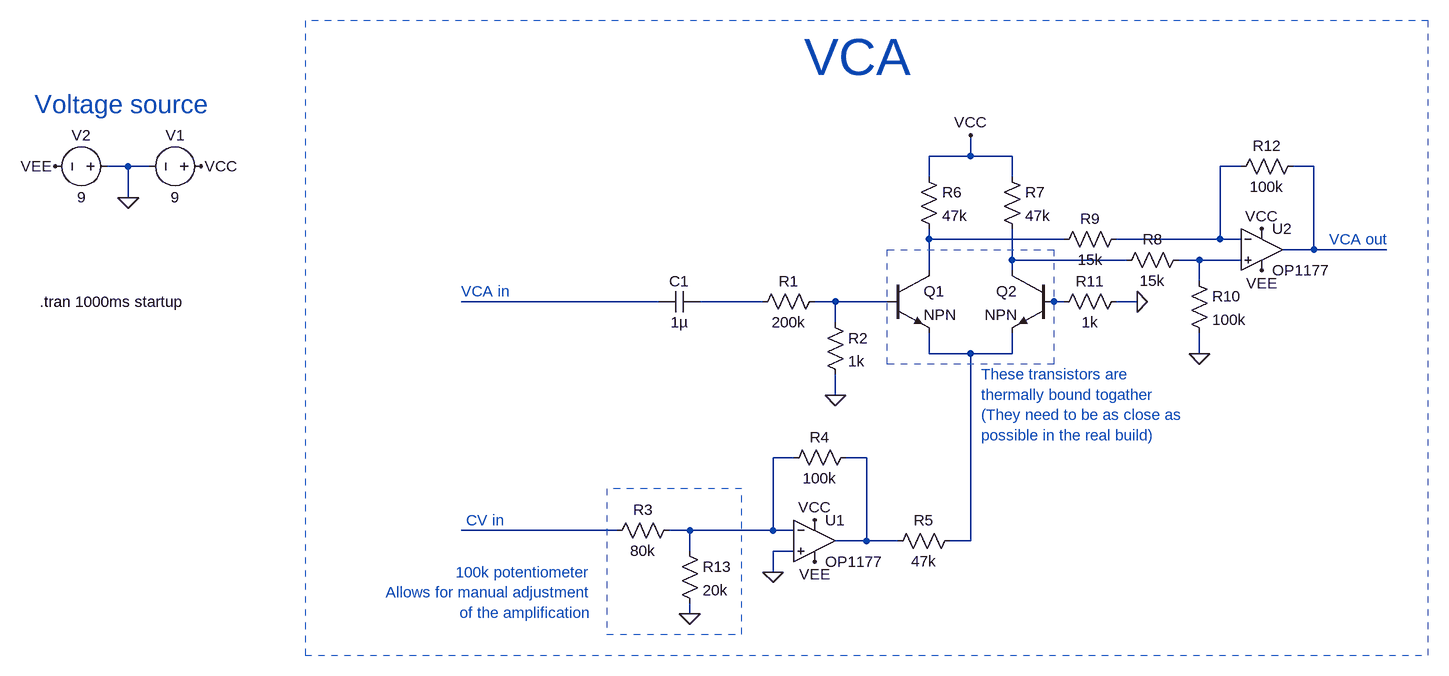
[diagram p0: schematic VCA-simulation.asc]
VCA-simulation.asc, the LTspice schematic file:
Version 4.1
SHEET 1 2860 1860
WIRE 2112 -16 2112 -48
WIRE 2112 -16 2048 -16
WIRE 2176 -16 2112 -16
WIRE 816 0 784 0
WIRE 848 0 816 0
WIRE 2528 0 2496 0
WIRE 2640 0 2608 0
WIRE 2048 16 2048 -16
WIRE 2176 16 2176 -16
WIRE 816 48 816 0
WIRE 2048 112 2048 96
WIRE 2256 112 2048 112
WIRE 2496 112 2496 0
WIRE 2496 112 2336 112
WIRE 2528 112 2496 112
WIRE 2640 128 2640 0
WIRE 2640 128 2592 128
WIRE 2752 128 2640 128
WIRE 2176 144 2176 96
WIRE 2352 144 2176 144
WIRE 2464 144 2432 144
WIRE 2528 144 2464 144
WIRE 2048 160 2048 112
WIRE 2176 160 2176 144
WIRE 2464 176 2464 144
WIRE 1632 208 1328 208
WIRE 1792 208 1696 208
WIRE 1904 208 1872 208
WIRE 1984 208 1904 208
WIRE 2240 208 2224 208
WIRE 2256 208 2240 208
WIRE 2368 208 2336 208
WIRE 1904 240 1904 208
WIRE 2048 288 2048 256
WIRE 2112 288 2048 288
WIRE 2176 288 2176 256
WIRE 2176 288 2112 288
WIRE 2464 288 2464 256
WIRE 1904 352 1904 320
WIRE 1840 448 1808 448
WIRE 1952 448 1920 448
WIRE 1568 560 1328 560
WIRE 1680 560 1648 560
WIRE 1808 560 1808 448
WIRE 1808 560 1680 560
WIRE 1840 560 1808 560
WIRE 1952 576 1952 448
WIRE 1952 576 1904 576
WIRE 2000 576 1952 576
WIRE 2112 576 2112 288
WIRE 2112 576 2080 576
WIRE 1680 592 1680 560
WIRE 1840 592 1808 592
WIRE 1808 624 1808 592
WIRE 1680 688 1680 672
FLAG 1904 352 0
FLAG 1808 624 0
FLAG 1872 544 VCC
FLAG 1872 608 VEE
FLAG 2112 -48 VCC
FLAG 2464 288 0
FLAG 2368 208 0
FLAG 2560 160 VEE
FLAG 2560 96 VCC
FLAG 1680 688 0
FLAG 704 0 VEE
FLAG 928 0 VCC
FLAG 816 48 0
SYMBOL cap 1696 192 R90
WINDOW 0 0 32 VBottom 2
WINDOW 3 32 32 VTop 2
SYMATTR InstName C1
SYMATTR Value 1µ
SYMBOL res 1888 192 R90
WINDOW 0 0 56 VBottom 2
WINDOW 3 32 56 VTop 2
SYMATTR InstName R1
SYMATTR Value 200k
SYMBOL res 1888 224 R0
SYMATTR InstName R2
SYMATTR Value 1k
SYMBOL npn 1984 160 R0
SYMATTR InstName Q1
SYMBOL npn 2240 160 M0
SYMATTR InstName Q2
SYMBOL res 1664 544 R90
WINDOW 0 0 56 VBottom 2
WINDOW 3 32 56 VTop 2
SYMATTR InstName R3
SYMATTR Value 80k
SYMBOL OpAmps\\OP1177 1872 512 R0
SYMATTR InstName U1
SYMBOL res 1936 432 R90
WINDOW 0 0 56 VBottom 2
WINDOW 3 32 56 VTop 2
SYMATTR InstName R4
SYMATTR Value 100k
SYMBOL res 2096 560 R90
WINDOW 0 0 56 VBottom 2
WINDOW 3 32 56 VTop 2
SYMATTR InstName R5
SYMATTR Value 47k
SYMBOL res 2032 0 R0
SYMATTR InstName R6
SYMATTR Value 47k
SYMBOL res 2160 0 R0
SYMATTR InstName R7
SYMATTR Value 47k
SYMBOL res 2448 128 R90
WINDOW 0 0 56 VBottom 2
WINDOW 3 32 56 VTop 2
SYMATTR InstName R8
SYMATTR Value 15k
SYMBOL res 2352 96 R90
WINDOW 0 0 56 VBottom 2
WINDOW 3 32 56 VTop 2
SYMATTR InstName R9
SYMATTR Value 15k
SYMBOL res 2448 160 R0
SYMATTR InstName R10
SYMATTR Value 100k
SYMBOL OpAmps\\OP1177 2560 64 R0
SYMATTR InstName U2
SYMBOL res 2240 224 R270
WINDOW 0 32 56 VTop 2
WINDOW 3 0 56 VBottom 2
SYMATTR InstName R11
SYMATTR Value 1k
SYMBOL res 2624 -16 R90
WINDOW 0 0 56 VBottom 2
WINDOW 3 32 56 VTop 2
SYMATTR InstName R12
SYMATTR Value 100k
SYMBOL res 1664 576 R0
SYMATTR InstName R13
SYMATTR Value 20k
SYMBOL voltage 944 0 R90
WINDOW 0 -32 56 VBottom 2
WINDOW 3 32 56 VTop 2
SYMATTR InstName V1
SYMATTR Value 9
SYMBOL voltage 800 0 R90
WINDOW 0 -32 56 VBottom 2
WINDOW 3 32 56 VTop 2
SYMATTR InstName V2
SYMATTR Value 9
TEXT 1856 -168 Left 6 ;VCA
TEXT 2128 320 Left 2 ;These transistors are\nthermally bound togather\n(They need to be as close as\npossible in the real build)
TEXT 1528 624 Right 2 ;100k potentiometer\nAllows for manual adjustment\nof the amplification
TEXT 1328 192 Left 2 ;VCA in
TEXT 2664 112 Left 2 ;VCA out
TEXT 1336 544 Left 2 ;CV in
TEXT 680 208 Left 2 !.tran 1000ms startup
TEXT 672 -96 Left 4 ;Voltage source
RECTANGLE Normal 2816 -224 1088 752 2
RECTANGLE Normal 2240 304 1984 128 2
RECTANGLE Normal 1552 720 1760 496 2

The netlist it stands for:
* VCA-simulation.asc
C1 N007 N006 1µ
R1 N008 N007 200k
R2 N008 0 1k
Q1 N003 N008 N010 0 NPN
Q2 N004 N009 N010 0 NPN
R3 N011 N013 80k
X§U1 0 N011 VCC VEE N012 OP1177  ; pins In+ In- V+ V- OUT
R4 N012 N011 100k
R5 N010 N012 47k
R6 VCC N003 47k
R7 VCC N004 47k
R8 N005 N004 15k
R9 N001 N003 15k
R10 N005 0 100k
X§U2 N005 N001 VCC VEE N002 OP1177  ; pins In+ In- V+ V- OUT
R11 N009 0 1k
R12 N002 N001 100k
R13 N011 0 20k
V1 VCC 0 9
V2 0 VEE 9
.model NPN NPN
.model PNP PNP
.lib standard.bjt
* VCA
* These transistors are
* thermally bound togather
* (They need to be as close as
* possible in the real build)
* 100k potentiometer
* Allows for manual adjustment
* of the amplification
* VCA in
* VCA out
* CV in
.tran 1000ms startup
* Voltage source
.lib ADI1.lib
.backanno
.end